# Altium schematic sheet Isolated_Output.SchDoc
size A; SheetNumber: 3; SheetTotal: 4
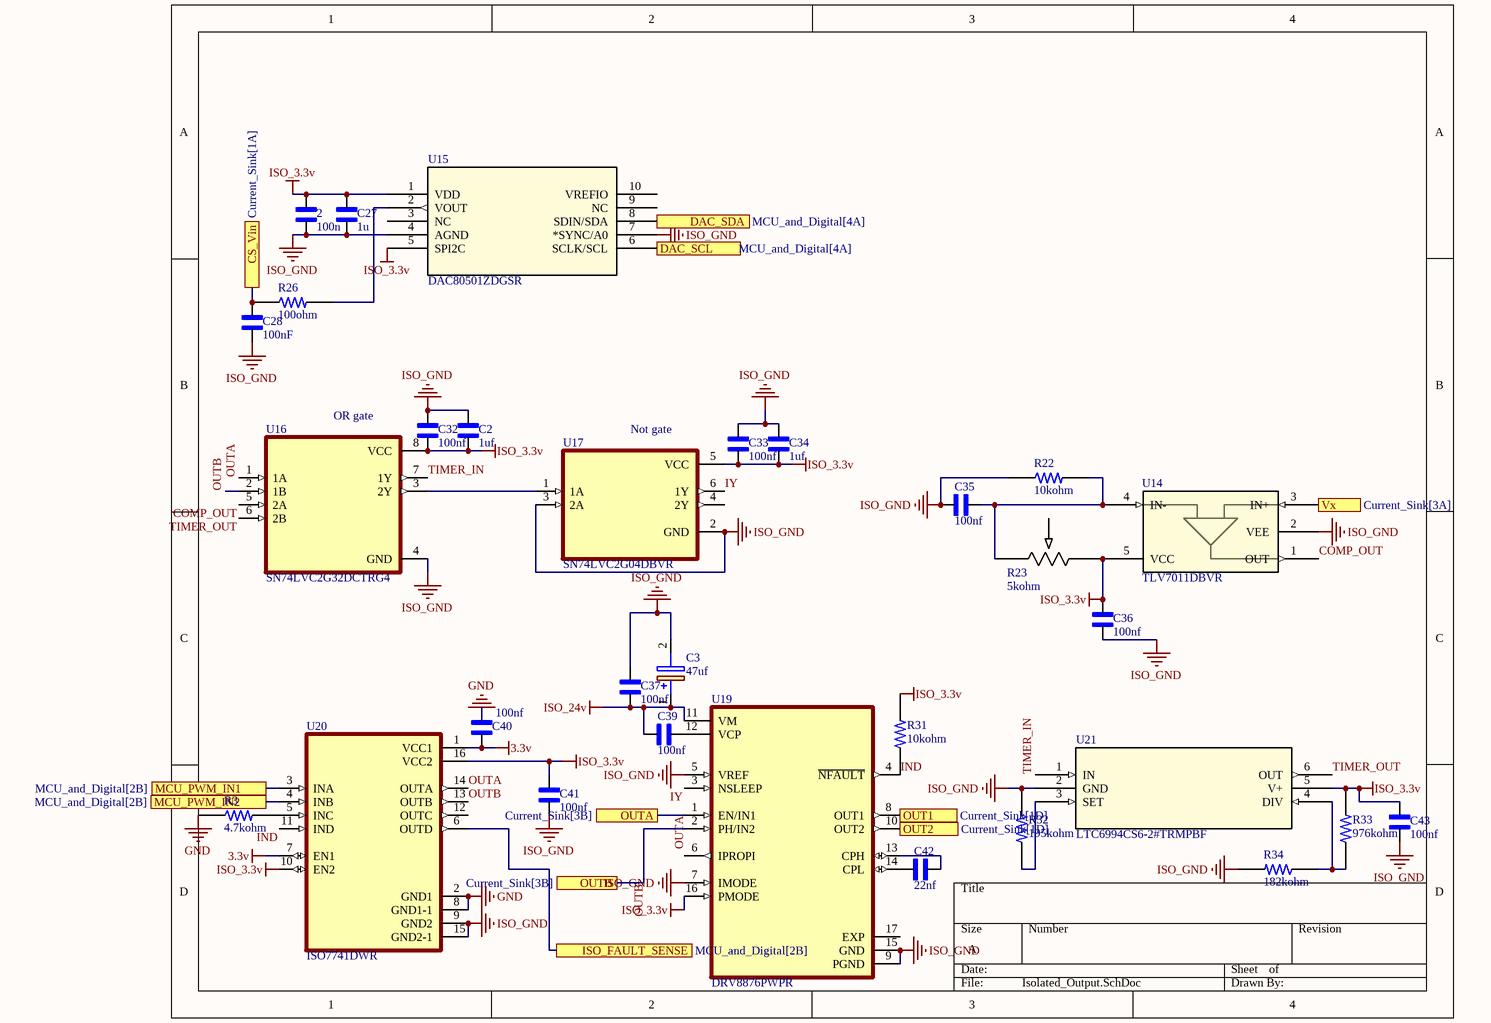
[diagram p0: Isolated_Output.SchDoc]

## Parts
2  100n  [CAPC1608X90]
C2  1uf  [CAPC1608X90]
C3  47uf  [CAPAE660X800N]
C27  1u  [CAPC1608X90]
C28  100nF  [CAPC1608X90]
C32  100nf  [CAPC1608X90]
C33  100nf  [CAPC1608X90]
C34  1uf  [CAPC1608X90]
C35  100nf  [CAPC1608X90]
C36  100nf  [CAPC1608X90]
C37  100nf  [CAPC1608X90]
C39  100nf  [CAPC1608X90]
C40  100nf  [CAPC1608X90]
C41  100nf  [CAPC1608X90]
C42  22nf  [CAPC1608X90]
C43  100nf  [CAPC1608X90]
R3  4.7kohm  [RESC1607X60N]
R22  10kohm  [RESC1607X60N]
R23  5kohm  [POT_T93XA_VIS]
R26  100ohm  [RESC1607X60N]
R31  10kohm  [RESC1607X60N]
R32  195kohm  [RESC1607X60N]
R33  976kohm  [RESC1607X60N]
R34  182kohm  [RESC1607X60N]
U14  TLV7011DBVR  [SOT_1DBVR_TEX]
U15  DAC80501ZDGSR  [DGS10_TEX]
U16  SN74LVC2G32DCTRG4  [SOP65P400X130-8N]
U17  SN74LVC2G04DBVR  [SOT95P280X145-6N]
U19  DRV8876PWPR  [IC_DRV8876PWPR]
U20  ISO7741DWR  [SOIC127P1030X265-16N]
U21  LTC6994CS6-2#TRMPBF  [TSOT-23_S6_LIT]

## Ports
CS_Vin (see Current_Sink[1A]), DAC_SCL (see MCU_and_Digital[4A]), DAC_SDA (see MCU_and_Digital[4A]), ISO_FAULT_SENSE (see MCU_and_Digital[2B]), MCU_PWM_IN1 (see MCU_and_Digital[2B]), MCU_PWM_IN2 (see MCU_and_Digital[2B]), OUT1 (see Current_Sink[1D]), OUT2 (see Current_Sink[1D]), OUTA (see Current_Sink[3B]), OUTB (see Current_Sink[3B]), Vx (see Current_Sink[3A])

## Nets
3.3v: C40.2 U20.1(VCC1) U20.7(EN1)
GND: C40.1 R3.1 U20.2(GND1) U20.8(GND1-1)
ISO_3.3v: 2.1 C2.1 C27.1 C32.1 C33.1 C34.1 C36.2 C41.1 C43.1 R23.3 R31.2 R33.2 U14.5(VCC) U15.1(VDD) U15.5(SPI2C) U16.8(VCC) U17.5(VCC) U19.16(PMODE) U20.10(EN2) U20.16(VCC2) U21.5(V+)
ISO_24v: C3.1(+) C37.2 C39.2 U19.11(VM)
ISO_GND: 2.2 C2.2 C3.2(-) C27.2 C28.2 C32.2 C33.2 C34.2 C35.1 C36.1 C37.1 C41.2 C43.2 R22.1 R32.2 R34.2 U14.2(VEE) U15.4(AGND) U15.7(*SYNC/A0) U16.4(GND) U17.2(GND) U17.3(2A) U19.5(VREF) U19.7(IMODE) U19.9(PGND) U19.15(GND) U20.9(GND2) U20.15(GND2-1) U21.2(GND)
COMP_OUT: U14.1(OUT) U16.5(2A)
CS_Vin: C28.1 R26.1 ; port CS_Vin
DAC_SCL: U15.6(SCLK/SCL) ; port DAC_SCL
DAC_SDA: U15.8(SDIN/SDA) ; port DAC_SDA
IND: R31.1 U19.4(~{NFAULT}) U20.11(IND)
ISO_FAULT_SENSE: U20.6(OUTD) ; port ISO_FAULT_SENSE
IY: U17.6(1Y) U19.3(NSLEEP)
MCU_PWM_IN1: U20.3(INA) ; port MCU_PWM_IN1
MCU_PWM_IN2: U20.4(INB) ; port MCU_PWM_IN2
OUT1: U19.8(OUT1) ; port OUT1
OUT2: U19.10(OUT2) ; port OUT2
OUTA: U16.1(1A) U19.1(EN/IN1) U20.14(OUTA) ; port OUTA
OUTB: U16.2(1B) U19.2(PH/IN2) U20.13(OUTB) ; port OUTB
TIMER_IN: U16.7(1Y) U21.1(IN)
TIMER_OUT: U16.6(2B) U21.6(OUT)
Vx: U14.3(IN+) ; port Vx
NetC35_2: C35.2 R22.2 R23.1 U14.4(IN-)
NetC39_1: C39.1 U19.12(VCP)
NetC42_1: C42.1 U19.13(CPH)
NetC42_2: C42.2 U19.14(CPL)
NetR3_2: R3.2 U20.5(INC)
NetR26_2: R26.2 U15.2(VOUT)
NetR32_1: R32.1 U21.3(SET)
NetR33_1: R33.1 R34.1 U21.4(DIV)
NetU16_3: U16.3(2Y) U17.1(1A)

Not connected (* = marked no-connect by the designer): R23 2; U15 3(NC) 9(NC) 10(VREFIO); U17 4(2Y); U19 6(IPROPI) 17(EXP); U20 12(OUTC)

## Notes on the sheet
- (near U16) OR gate
- (near U17) Not gate

## Library data of the parts
2 C2 C27 C28 C32-C37 C39-C43 = C0603KRX7R9BB102: 0603 1 nF 50 V Â±10 % Tolerance X7R Surface Mount Ceramic Capacitor; MF: Yageo; SnapEDA_Link: https://www.snapeda.com/parts/C0603KRX7R9BB102/Yageo/view-part/?ref=snap; Package: 0603 Yageo; Value: *; MP: C0603KRX7R9BB102; Check_prices: https://www.snapeda.com/parts/C0603KRX7R9BB102/Yageo/view-part/?ref=eda
C3 = GYF1H470MCQ1GS: Capacitor Polarised; Manufacturer_Name: Nichicon; Datasheet Link: https://www.nichicon.co.jp/english/series_items/catalog_pdf/e-gyf.pdf; Height: 8mm; Manufacturer_Part_Number: GYF1H470MCQ1GS
R3 R22 R26 R31-R34 = RC0603JR-0710KL: 10 kOhms Â±5% 0.1W, 1/10W Chip Resistor 0603 (1608 Metric) Moisture Resistant Thick Film; MF: Yageo; SnapEDA_Link: https://www.snapeda.com/parts/RC0603JR-0710KL/Yageo/view-part/?ref=snap; Package: 0603 Yageo; Value: *; MP: RC0603JR-0710KL; Check_prices: https://www.snapeda.com/parts/RC0603JR-0710KL/Yageo/view-part/?ref=eda
R23 = T93XA104KT20: T93 XA 100K 10% TU50 e3; Manufacturer_Name: Vishay; Copyright: Copyright (C) 2026 Ultra Librarian. All rights reserved.; Manufacturer_Part_Number: T93XA104KT20; Datasheet: https://www.vishay.com/doc?51026
U14 = TLV7011DBVR: Low power, small size comparator with push-pull output 5-SOT-23 -40 to 125; Manufacturer_Name: Texas Instruments; Copyright: Copyright (C) 2026 Ultra Librarian. All rights reserved.; Manufacturer_Part_Number: TLV7011DBVR; RefDes: RefDes; Type: Type
U15 = DAC80501ZDGSR: True 16-bit, 1-ch, SPI/I2C, voltage-output DAC in WSON package with precision internal reference 10-VSSOP -40 to 125; Manufacturer_Name: Texas Instruments; Copyright: Copyright (C) 2025 Ultra Librarian. All rights reserved.; Manufacturer_Part_Number: DAC80501ZDGSR; RefDes: RefDes; Type: Type
U16 = SN74LVC2G32DCTRG4: Dual 2-Input Positive-OR Gate 8-SM8 -40 to 125; MF: Texas Instruments; SnapEDA_Link: https://www.snapeda.com/parts/SN74LVC2G32DCTRG4/Texas+Instruments/view-part/?ref=snap; Package: SSOP-8 Texas Instruments; Value: *; MP: SN74LVC2G32DCTRG4; Check_prices: https://www.snapeda.com/parts/SN74LVC2G32DCTRG4/Texas+Instruments/view-part/?ref=eda
U17 = SN74LVC2G04DBVR: 2-ch, 1.65-V to 5.5-V inverters; MF: Texas Instruments; SnapEDA_Link: https://www.snapeda.com/parts/SN74LVC2G04DBVR/Texas+Instruments/view-part/?ref=snap; Package: SOT-23-6 Texas Instruments; Value: *; MP: SN74LVC2G04DBVR; Check_prices: https://www.snapeda.com/parts/SN74LVC2G04DBVR/Texas+Instruments/view-part/?ref=eda
U19 = DRV8876PWPR: 40-V, 3.5-A H-bridge motor driver with integrated current sensing & current-sense feedback; MF: Texas Instruments; SnapEDA_Link: https://www.snapeda.com/parts/DRV8876PWPR/Texas+Instruments/view-part/?ref=snap; Package: HTSSOP-16 Texas Instruments; Value: *; MP: DRV8876PWPR; Check_prices: https://www.snapeda.com/parts/DRV8876PWPR/Texas+Instruments/view-part/?ref=eda
U20 = ISO7741DWR: Robust EMC, quad-channel, 3/1, reinforced digital isolator; MF: Texas Instruments; SnapEDA_Link: https://www.snapeda.com/parts/ISO7741DWR/Texas+Instruments/view-part/?ref=snap; Package: SOIC-16 Texas Instruments; Value: *; MP: ISO7741DWR; Check_prices: https://www.snapeda.com/parts/ISO7741DWR/Texas+Instruments/view-part/?ref=eda
U21 = LTC6994CS6-2TRMPBF: Description; Manufacturer_Name: Analog Devices Inc; Copyright: Copyright (C) 2025 Ultra Librarian. All rights reserved.; Manufacturer_Part_Number: LTC6994CS6-2#TRMPBF; RefDes: RefDes; Type: Type